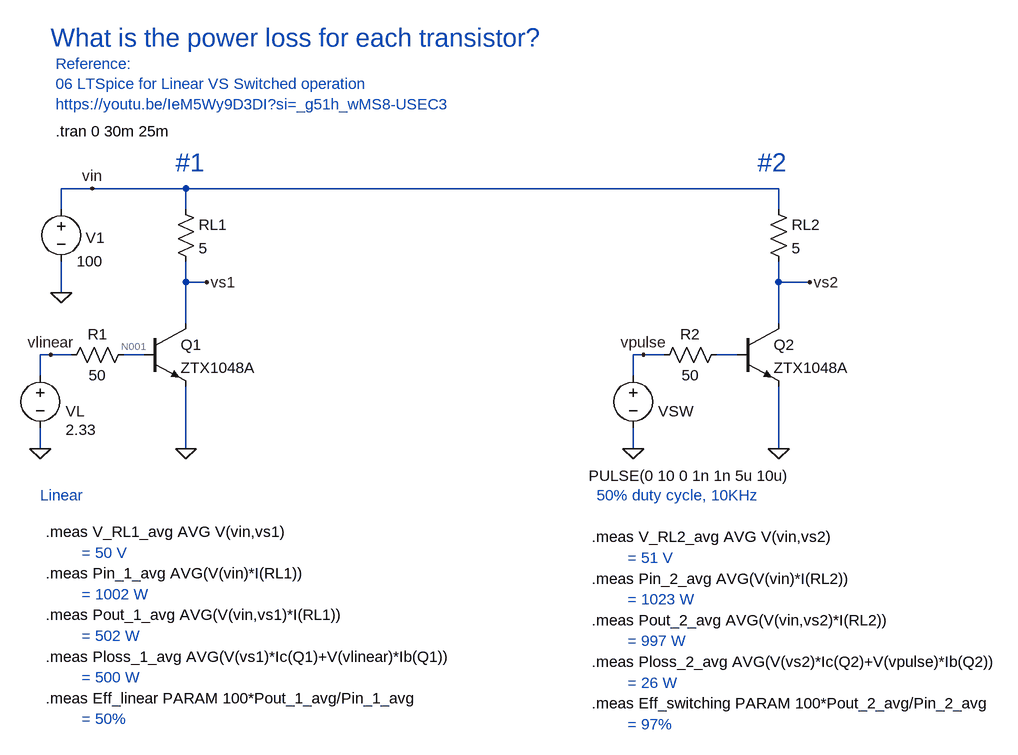
[diagram p0: schematic 13-linear_vs_switching.asc]
13-linear_vs_switching.asc, the LTspice schematic file:
Version 4
SHEET 1 1460 872
WIRE 0 32 -48 32
WIRE 144 32 0 32
WIRE 1056 32 144 32
WIRE -48 64 -48 32
WIRE 144 64 144 32
WIRE 1056 64 1056 32
WIRE 144 176 144 144
WIRE 176 176 144 176
WIRE 1056 176 1056 144
WIRE 1104 176 1056 176
WIRE -48 192 -48 144
WIRE 144 240 144 176
WIRE 1056 240 1056 176
WIRE -64 288 -80 288
WIRE -32 288 -64 288
WIRE 80 288 48 288
WIRE 848 288 832 288
WIRE 880 288 848 288
WIRE 992 288 960 288
WIRE -80 320 -80 288
WIRE 832 320 832 288
WIRE -80 432 -80 400
WIRE 144 432 144 336
WIRE 832 432 832 400
WIRE 1056 432 1056 336
FLAG -48 192 0
FLAG 0 32 vin
FLAG 144 432 0
FLAG -80 432 0
FLAG 1056 432 0
FLAG 832 432 0
FLAG 848 288 vpulse
FLAG 176 176 vs1
FLAG 1104 176 vs2
FLAG -64 288 vlinear
SYMBOL voltage -48 48 R0
WINDOW 0 38 60 Left 2
WINDOW 123 0 0 Left 0
WINDOW 39 0 0 Left 0
SYMATTR InstName V1
SYMATTR Value 100
SYMBOL npn 80 240 R0
SYMATTR InstName Q1
SYMATTR Value ZTX1048A
SYMBOL voltage -80 304 R0
WINDOW 0 39 71 Left 2
WINDOW 3 39 99 Left 2
WINDOW 123 0 0 Left 0
WINDOW 39 0 0 Left 0
SYMATTR InstName VL
SYMATTR Value 2.33
SYMBOL res 128 48 R0
SYMATTR InstName RL1
SYMATTR Value 5
SYMBOL res 64 272 R90
WINDOW 0 0 56 VBottom 2
WINDOW 3 32 56 VTop 2
SYMATTR InstName R1
SYMATTR Value 50
SYMBOL voltage 832 304 R0
WINDOW 0 39 71 Left 2
WINDOW 3 -68 170 Left 2
WINDOW 123 0 0 Left 0
WINDOW 39 0 0 Left 0
SYMATTR InstName VSW
SYMATTR Value PULSE(0 10 0 1n 1n 5u 10u)
SYMBOL res 1040 48 R0
SYMATTR InstName RL2
SYMATTR Value 5
SYMBOL res 976 272 R90
WINDOW 0 0 56 VBottom 2
WINDOW 3 32 56 VTop 2
SYMATTR InstName R2
SYMATTR Value 50
SYMBOL npn 992 240 R0
SYMATTR InstName Q2
SYMATTR Value ZTX1048A
TEXT -56 -56 Left 2 !.tran 0 30m 25m
TEXT -64 -200 Left 4 ;What is the power loss for each transistor?
TEXT 776 504 Left 2 ;50% duty cycle, 10KHz
TEXT -80 504 Left 2 ;Linear
TEXT -72 560 Left 2 !.meas V_RL1_avg AVG V(vin,vs1)
TEXT -16 592 Left 2 ;= 50 V
TEXT -72 624 Left 2 !.meas Pin_1_avg AVG(V(vin)*I(RL1))
TEXT -16 656 Left 2 ;= 1002 W
TEXT -72 688 Left 2 !.meas Pout_1_avg AVG(V(vin,vs1)*I(RL1))
TEXT 128 -8 Left 4 ;#1
TEXT 1024 -8 Left 4 ;#2
TEXT -16 720 Left 2 ;= 502 W
TEXT -72 752 Left 2 !.meas Ploss_1_avg AVG(V(vs1)*Ic(Q1)+V(vlinear)*Ib(Q1))
TEXT -16 784 Left 2 ;= 500 W
TEXT -72 816 Left 2 !.meas Eff_linear PARAM 100*Pout_1_avg/Pin_1_avg
TEXT -56 -160 Left 2 ;Reference:\n06 LTSpice for Linear VS Switched operation\nhttps://youtu.be/IeM5Wy9D3DI?si=_g51h_wMS8-USEC3
TEXT -16 848 Left 2 ;= 50%
TEXT 768 568 Left 2 !.meas V_RL2_avg AVG V(vin,vs2)
TEXT 824 600 Left 2 ;= 51 V
TEXT 768 632 Left 2 !.meas Pin_2_avg AVG(V(vin)*I(RL2))
TEXT 824 664 Left 2 ;= 1023 W
TEXT 768 696 Left 2 !.meas Pout_2_avg AVG(V(vin,vs2)*I(RL2))
TEXT 824 728 Left 2 ;= 997 W
TEXT 768 760 Left 2 !.meas Ploss_2_avg AVG(V(vs2)*Ic(Q2)+V(vpulse)*Ib(Q2))
TEXT 824 792 Left 2 ;= 26 W
TEXT 768 824 Left 2 !.meas Eff_switching PARAM 100*Pout_2_avg/Pin_2_avg
TEXT 824 856 Left 2 ;= 97%

The netlist it stands for:
* 13-linear_vs_switching.asc
V1 vin 0 100
Q1 vs1 N001 0 0 ZTX1048A
VL vlinear 0 2.33
RL1 vin vs1 5
R1 N001 vlinear 50
VSW vpulse 0 PULSE(0 10 0 1n 1n 5u 10u)
RL2 vin vs2 5
R2 N002 vpulse 50
Q2 vs2 N002 0 0 ZTX1048A
.model NPN NPN
.model PNP PNP
.lib standard.bjt
.tran 0 30m 25m
* What is the power loss for each transistor?
* 50% duty cycle, 10KHz
* Linear
.meas V_RL1_avg AVG V(vin,vs1)
* = 50 V
.meas Pin_1_avg AVG(V(vin)*I(RL1))
* = 1002 W
.meas Pout_1_avg AVG(V(vin,vs1)*I(RL1))
* #1
* #2
* = 502 W
.meas Ploss_1_avg AVG(V(vs1)*Ic(Q1)+V(vlinear)*Ib(Q1))
* = 500 W
.meas Eff_linear PARAM 100*Pout_1_avg/Pin_1_avg
* Reference:
* 06 LTSpice for Linear VS Switched operation
* https://youtu.be/IeM5Wy9D3DI?si=_g51h_wMS8-USEC3
* = 50%
.meas V_RL2_avg AVG V(vin,vs2)
* = 51 V
.meas Pin_2_avg AVG(V(vin)*I(RL2))
* = 1023 W
.meas Pout_2_avg AVG(V(vin,vs2)*I(RL2))
* = 997 W
.meas Ploss_2_avg AVG(V(vs2)*Ic(Q2)+V(vpulse)*Ib(Q2))
* = 26 W
.meas Eff_switching PARAM 100*Pout_2_avg/Pin_2_avg
* = 97%
.backanno
.end

* Results of the author's LTspice run, read from the files saved beside the schematic
* Operating Point, zero values left out:
*   V(vin) = 100 V
*   V(vs1) = 49.86 V
*   V(n001) = 999.1 mV
*   V(vlinear) = 2.33 V
*   V(vs2) = 100 V
*   Ic(Q1) = 10.03 A
*   Ib(Q1) = 26.62 mA
*   Ie(Q1) = -10.06 A
*   Ic(Q2) = 103.7 pA
*   Ib(Q2) = -101.6 pA
*   Ie(Q2) = -2.517 pA
*   I(Rl1) = 10.03 A
*   I(R1) = -26.62 mA
*   I(Rl2) = 104.1 pA
*   I(R2) = 101.6 pA
*   I(V1) = -10.03 A
*   I(Vl) = -26.62 mA
*   I(Vsw) = 101.6 pA
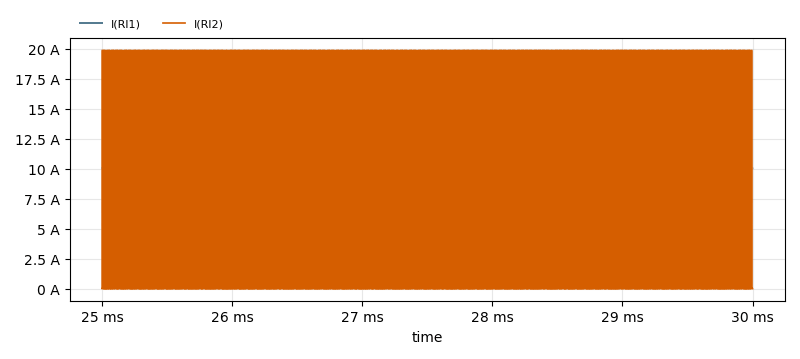
[diagram p1: Transient Analysis of 13-linear_vs_switching.asc, plotted from the saved traces]
* Transient Analysis, 1 run:
*   I(Rl1): min 10.03 A, max 10.03 A, average 10.03 A, rms 10.03 A, last 10.03 A
*   I(Rl2): min -8.839 mA, max 19.86 A, average 10.24 A, rms 14.13 A, last 0 A
* From the log:
*   v_rl1_avg: AVG(v(vin,vs1))=50.1425 FROM 0 TO 0.005
*   pin_1_avg: AVG(v(vin)*i(rl1))=1002.85 FROM 0 TO 0.005
*   pout_1_avg: AVG(v(vin,vs1)*i(rl1))=502.855 FROM 0 TO 0.005
*   ploss_1_avg: AVG(v(vs1)*ic(q1)+v(vlinear)*ib(q1))=500.058 FROM 0 TO 0.005
*   eff_linear: 100*pout_1_avg/pin_1_avg=50.1425
*   v_rl2_avg: AVG(v(vin,vs2))=51.1859 FROM 0 TO 0.005
*   pin_2_avg: AVG(v(vin)*i(rl2))=1023.72 FROM 0 TO 0.005
*   pout_2_avg: AVG(v(vin,vs2)*i(rl2))=997.906 FROM 0 TO 0.005
*   ploss_2_avg: AVG(v(vs2)*ic(q2)+v(vpulse)*ib(q2))=26.684 FROM 0 TO 0.005
*   eff_switching: 100*pout_2_avg/pin_2_avg=97.4786